# EAGLE design Jalousie_1K_0.1 (EAGLE 5.04)
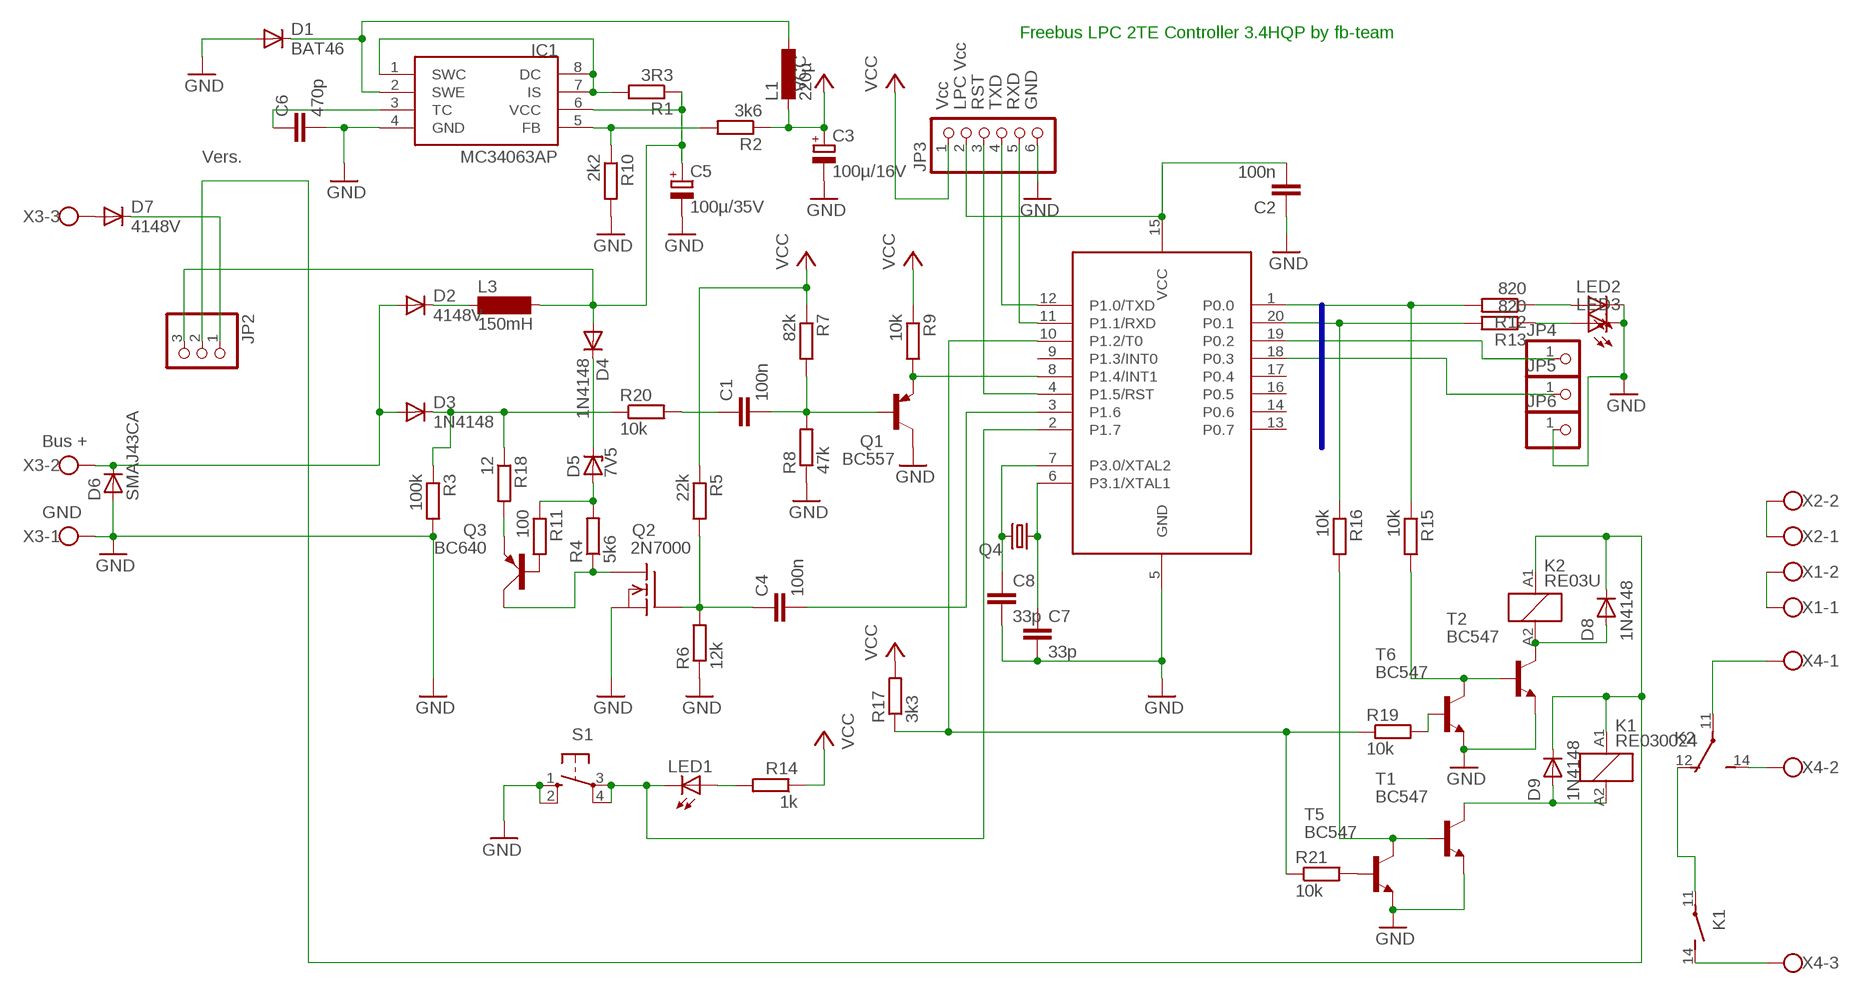
[diagram p0: schematic, sheet 1]

## Parts
C1  100n  C-EU050-024X044  [C050-024X044]
C2  100n  C-EU050-024X044  [C050-024X044]
C3  100µ/16V  CPOL-EUE2.5-5  [E2,5-5]
C4  100n  C-EU050-024X044  [C050-024X044]
C5  100µ/35V  CPOL-EUE3.5-8  [E3,5-8]
C6  470p  C-EU025-024X044  [C025-024X044]
C7  33p  C-EU025-025X050  [C025-025X050]
C8  33p  C-EU025-025X050  [C025-025X050]
D1  BAT46  BAT81  [DO34-7]
D2  4148V  1N41481448V  [D-2.5]
D3  1N4148  1N41481448V  [D-2.5]
D4  1N4148  1N41481448V  [D-2.5]
D5  7V5  ZPD  [DO35Z10]
D6  SMAJ43CA  D-SMB  [SMB]
D7  4148V  1N41481448V  [D-2.5]
D8  1N4148  DO35-STEHEND  [DO35-S]
D9  1N4148  DO35-STEHEND  [DO35-S]
IC1  MC34063AP  [DIL08]
JP2  PINHD-1X3  [1X03]
JP3  PINHD-1X6  [1X06]
JP4  PINHD-1X1  [1X01]
JP5  PINHD-1X1  [1X01]
JP6  PINHD-1X1  [1X01]
K1  RE030024  [RE-SCHRACK]
K2  RE03U  [G5Q_1_EU]
L1  220µ  L-EU0207/12  [0207/12]
L3  150mH  BS11  [BS11]
LED1  LED3MM  [LED3MM]
LED2  LED3MM  [LED3MM]
LED3  LED3MM  [LED3MM]
Q1  BC557  [TO92]
Q2  2N7000  VN2222KM  [TO237]
Q3  BC640  [SOT54D]
Q4  CRYSTALHC49S  [HC49/S]
R1  3R3  R-EU_0207/2V  [0207/2V]
R2  3k6  R-EU_0207/5V  [0207/5V]
R3  100k  R-EU_0207/2V  [0207/2V]
R4  5k6  R-EU_0207/2V  [0207/2V]
R5  22k  R-EU_0207/2V  [0207/2V]
R6  12k  R-EU_0207/2V  [0207/2V]
R7  82k  R-EU_0207/2V  [0207/2V]
R8  47k  R-EU_0207/2V  [0207/2V]
R9  10k  R-EU_0207/2V  [0207/2V]
R10  2k2  R-EU_0207/2V  [0207/2V]
R11  100  R-EU_0207/2V  [0207/2V]
R12  820  R-EU_0207/7  [0207/7]
R13  820  R-EU_0207/10  [0207/10]
R14  1k  R-EU_0207/2V  [0207/2V]
R15  10k  R-EU_0207/7  [0207/7]
R16  10k  R-EU_0207/10  [0207/10]
R17  3k3  R-EU_0207/2V  [0207/2V]
R18  12  R-EU_0207/2V  [0207/2V]
R19  10k  R-EU_0207/7  [0207/7]
R20  10k  R-EU_0207/2V  [0207/2V]
R21  10k  R-EU_0207/7  [0207/7]
S1  10-XX  [B3F-10XX]
T1  BC547  [TO92]
T2  BC547  [TO92]
T5  BC547  [TO92]
T6  BC547  [TO92]
U1  89LPC922  [DIL20]
X1  W237-02P  [W237-132]
X2  W237-02P  [W237-132]
X3  W237-3E  [W237-3E]
X4  W237-03P  [W237-133]

## Nets
EIB+: D2.A D3.A D6.1(C) X3.2
GND: C2.1 C3.- C5.- C6.2 C7.2 C8.2 D1.A D6.2(A) IC1.4(GND) JP3.6 JP6.1 LED2.K(C) LED3.K(C) Q1.3(C) Q2.3(S) R3.2 R6.1 R8.1 R10.2 S1.1(S) S1.2(S1) T1.1(E) T2.1(E) T5.1(E) T6.1(E) U1.5(GND) X3.1
N$1: Q1.1(E) R9.2 U1.8(P1.4/INT1)
N$2: C1.2 Q1.2(B) R7.2 R8.2
N$3: K2.14(14:S) X4.2
N$4: D3.C R3.1 R18.1 R20.1
N$5: C4.2 U1.3(P1.6)
N$6: K1.14(2:S) X4.3
N$7: LED1.K(C) S1.3(P) S1.4(P1) U1.2(P1.7)
N$8: IC1.1(SWC) IC1.7(IS) IC1.8(DC) R1.2
N$9: LED1.A R14.2
N$10: C5.+ D4.A IC1.6(VCC) JP2.3 L3.2 R1.1
N$11: IC1.5(FB) R2.2 R10.1
N$12: D1.C IC1.2(SWE) L1.1
N$13: D2.C L3.1
N$14: C6.1 IC1.3(TC)
N$15: D4.C D5.C
N$16: K2.11(14:P) X4.1
N$17: K1.11(2:P) K2.12(14:O)
N$18: X1.1 X1.2
N$19: D9.P$1(A) K1.A2 T1.3(C)
N$20: LED2.A R12.1
N$21: LED3.A R13.1
N$22: X2.1 X2.2
N$23: D7.C JP2.1
N$24: D8.P$1(A) K2.A2 T2.3(C)
N$25: D5.A R4.2 R11.1
N$26: Q2.1(D) Q3.C R4.1
N$28: Q3.B R11.2
N$29: JP3.4 U1.12(P1.0/TXD)
N$30: JP3.5 U1.11(P1.1/RXD)
N$31: JP3.3 U1.4(P1.5/RST)
N$32: C2.2 JP3.2 U1.15(VCC)
N$33: Q3.E R18.2
N$34: C4.1 Q2.2(G) R5.2 R6.2
N$35: R15.2 T2.2(B) T6.3(C)
N$36: D7.A X3.3
N$37: R16.2 T1.2(B) T5.3(C)
N$38: JP4.1 U1.19(P0.2)
N$39: JP5.1 U1.18(P0.3)
N$41: C1.1 R20.2
N$43: R19.2 T6.2(B)
N$44: R21.2 T5.2(B)
P0.0: R12.2 R15.1 U1.1(P0.0)
P0.1: R13.2 R16.1 U1.20(P0.1)
PWM: R17.1 R19.1 R21.1 U1.10(P1.2/T0)
VCC: C3.+ JP3.1 L1.2 R2.1 R5.1 R7.1 R9.1 R14.1 R17.2
VDD_IN: D8.P$2(B) D9.P$2(B) JP2.2 K1.A1 K2.A1
XTAL1: C7.1 Q4.1 U1.6(P3.1/XTAL1)
XTAL2: C8.1 Q4.2 U1.7(P3.0/XTAL2)
Unconnected: U1.9(P1.3/INT0) U1.13(P0.7) U1.14(P0.6) U1.16(P0.5) U1.17(P0.4)

## Buses
P0.[0..3]

## Notes on the sheet
- Freebus LPC 2TE Controller 3.4HQP by fb-team
- Vcc | LPC Vcc | RST | TXD | RXD | GND
- Vers.
- Bus +
- GND

## Library data of the parts
C1 C2 C4 C6-C8 = rcl:C-EU: CAPACITOR, European symbol
C3 C5 = rcl:CPOL-EU: POLARIZED CAPACITOR, European symbol
D1 = diode:BAT81: DIODE barrier diode
D2-D4 D7 = diode:1N4148: DIODE high speed (Philips)
D5 = diode:ZPD: Z DIODE 500 mW
D6 = semicon-smd-ipc:D-: DIODE unfilled
D8 D9 = kubi:DO35-STEHEND
IC1 = mc34063:MC34063
JP2 = pinhead:PINHD-1X3: PIN HEADER
JP3 = pinhead:PINHD-1X6: PIN HEADER
JP4-JP6 = pinhead:PINHD-1X1: PIN HEADER
K1 = relay:RE03*: Miniature PCB Relay 1 pole 6 A SCHRACK Source: http://www.schrack.com/.. 5812.pdf
K2 = freebus_relay:RE03U
L1 = rcl:L-EU: INDUCTOR, European symbol
L3 = inductor-neosid:BS: INDUCTOR nominal inductance, magnetically screened
LED1-LED3 = led:LED: LED OSRAM: - CHIPLED LG R971, LG N971, LY N971, LG Q971, LY Q971, LO R971, LY R971 LH N974, LH R974 LS Q976, LO Q976, LY Q976 LO Q996 - Hyper CHIPLED LW Q18S LB Q993, LB Q99A, LB R99A - SideLED LS A670, LO A670, LY A670, LG A670, LP A670 LB A673, LV A673, LT A673, LW A673 LH A674 LY A675 LS A676, LA A676, LO A676, LY A676, LW A676 LS A679, LY A679, LG A679 - Hyper Micro SIDELED® LS Y876, LA Y876, LO Y876, LY Y876 LT Y87S - SmartLED LW L88C, LW L88S LB L89C, LB L89S, LG L890 LS L89K, LO L89K, LY L89K LS L896, LA L896, LO L896, LY L896 - TOPLED LS T670, LO T670, LY T670, LG T670, LP T670 LSG T670, LSP T670, LSY T670, LOP T670, LYG T670 LG T671, LOG T671, LSG T671 LB T673, LV T673, LT T673, LW T673 LH T674 LS T676, LA T676, LO T676, LY T676, LB T676, LH T676, LSB T676, LW T676 LB T67C, LV T67C, LT T67C, LS T67K, LO T67K, LY T67K, LW E67C LS E67B, LA E67B, LO E67B, LY E67B, LB E67C, LV E67C, LT E67C LW T67C LS T679, LY T679, LG T679 LS T770, LO T770, LY T770, LG T770, LP T770 LB T773, LV T773, LT T773, LW T773 LH T774 LS E675, LA E675, LY E675, LS T675 LS T776, LA T776, LO T776, LY T776, LB T776 LHGB T686 LT T68C, LB T68C - Hyper Mini TOPLED® LB M676 - Mini TOPLED Santana® LG M470 LS M47K, LO M47K, LY M47K Source: http://www.osram.convergy.de - LUMILED® LXK2-PW12-R00, LXK2-PW12-S00, LXK2-PW14-U00, LXK2-PW14-V00 LXK2-PM12-R00, LXK2-PM12-S00, LXK2-PM14-U00 LXK2-PE12-Q00, LXK2-PE12-R00, LXK2-PE12-S00, LXK2-PE14-T00, LXK2-PE14-U00 LXK2-PB12-K00, LXK2-PB12-L00, LXK2-PB12-M00, LXK2-PB14-N00, LXK2-PB14-P00, LXK2-PB14-Q00 LXK2-PR12-L00, LXK2-PR12-M00, LXK2-PR14-Q00, LXK2-PR14-R00 LXK2-PD12-Q00, LXK2-PD12-R00, LXK2-PD12-S00 LXK2-PH12-R00, LXK2-PH12-S00 LXK2-PL12-P00, LXK2-PL12-Q00, LXK2-PL12-R00 Source: www.luxeon.com
Q1 = transistor-pnp:BC557: PNP Transistor
Q2 = transistor-fet:VN2222KM: N-Channel Enhancement MOSFET (VMOS); 60V; 0,5A; 7,5Ohm
Q3 = transistor-small-signal:BC640: PNP TRANSISTOR
Q4 = crystal:CRYSTAL: CRYSTAL
R1-R21 = rcl:R-EU_: RESISTOR, European symbol
S1 = switch-omron:10-XX: OMRON SWITCH
T1 T2 T5 T6 = transistor-npn:BC547*: NPN Transistor
U1 = micro-philips:89LPC922
X1 X2 = con-wago-508:W237-02P: WAGO SREW CLAMP
X3 = con-wago-508:W237-3E: WAGO SREW CLAMP
X4 = con-wago-508:W237-03P: WAGO SREW CLAMP

## Board
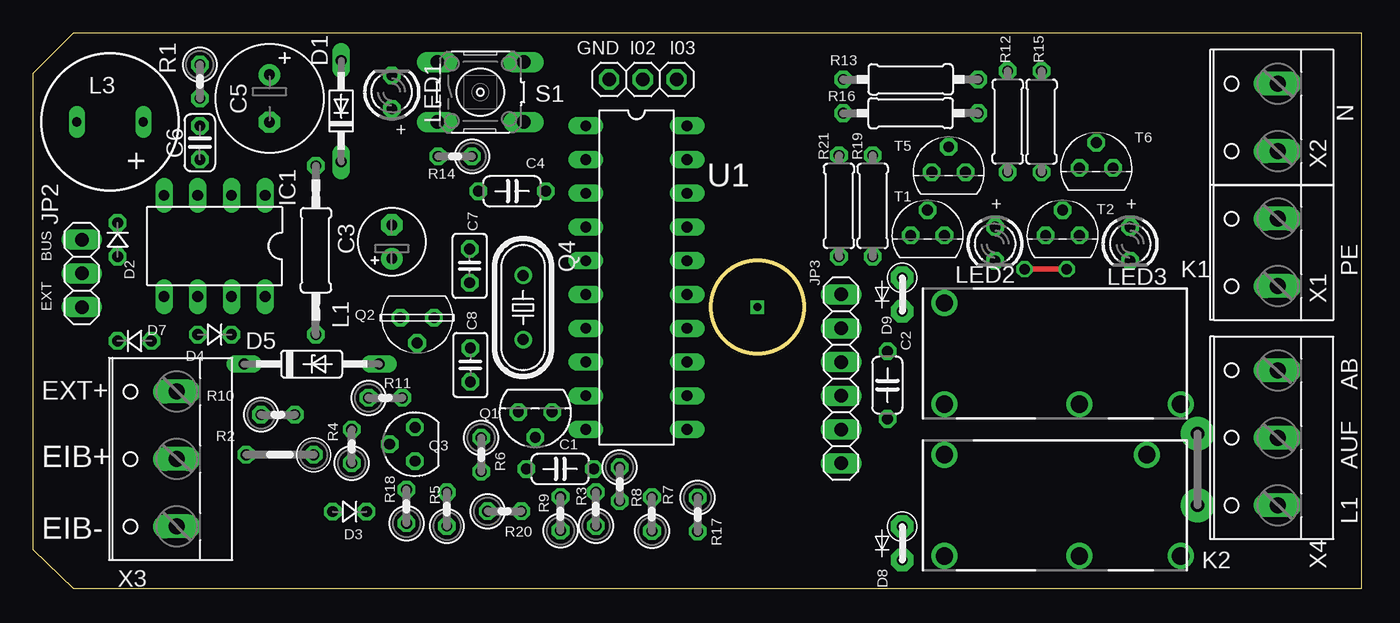
[diagram p1: board, top side]
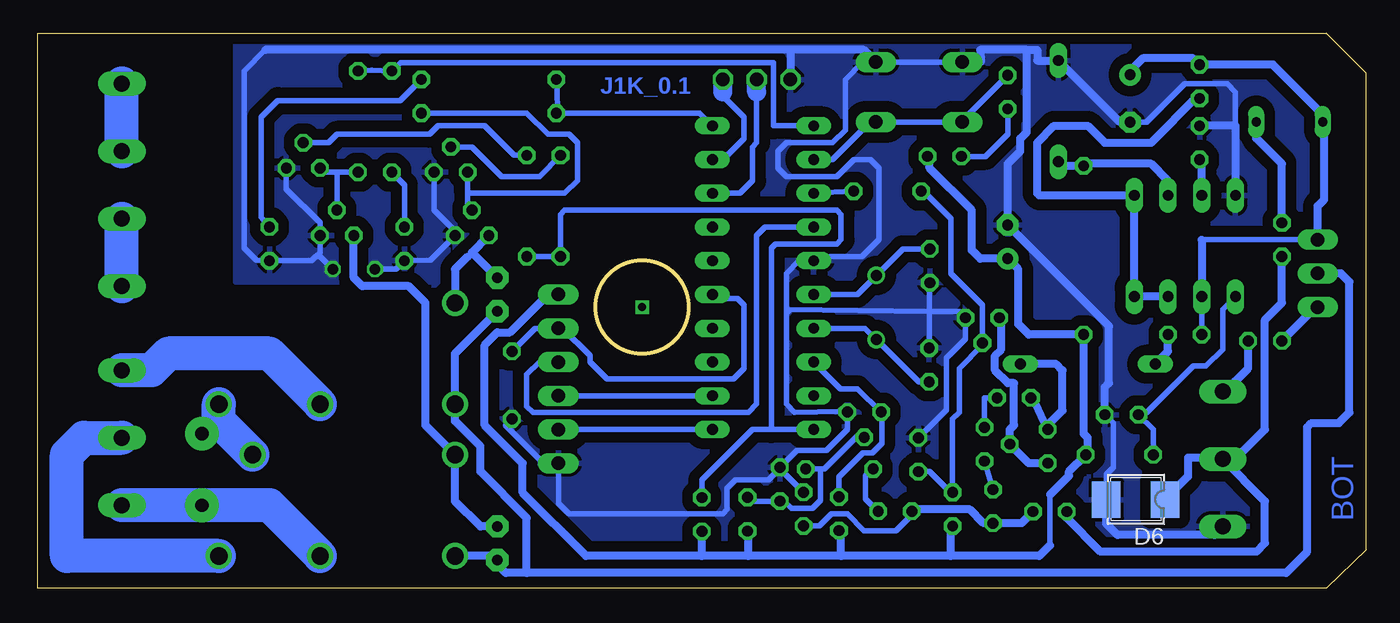
[diagram p2: board, bottom side, seen from below]

Size 100 x 41.8 mm. Coordinates in mm from the lower left corner, seen from the top.
Outline: 0,2.9 3,0 100,0 100,41.8 3,41.8 0,38.8 0,2.9
Outline: circle at 54.5,21.17 radius 3.49
Copper layers (1*16): Top 0.035mm / dielectric 1.5mm / Bottom 0.035mm
Design rules "default *": minimum track width 10mil, minimum drill 24mil, track to track 8mil, track to pad 8mil, pad to pad 8mil, via to via 8mil, smd to smd 8mil, copper to edge 25mil, drill to drill 8mil, minimum pad ring 10mil, minimum via ring 8mil, stop-mask expansion 4mil, vias tented up to drill 0mil, thermal gap 10mil

### Footprints (pad centres in the part's own frame; a part is rotated, then mirrored left to right if it is on the bottom)
C050-024X044 = drill 0.813 octagon: 1 -2.54,0; 2 2.54,0
E2,5-5 = drill 0.813 pad 1.6 round: + -1.27,0 | drill 0.813 pad 1.6 octagon: - 1.27,0
E3,5-8 = drill 0.813 pad 1.6 round: + -1.778,0 | drill 0.813 pad 1.6 octagon: - 1.778,0
C025-024X044 = drill 0.813 octagon: 1 -1.27,0; 2 1.27,0
C025-025X050 = drill 0.813 octagon: 1 -1.27,0; 2 1.27,0
DO34-7 = drill 0.813 long: A 3.81,0; C -3.81,0
D-2.5 = drill 0.813 octagon: A 1.27,0; C -1.27,0
DO35Z10 = drill 0.813 long: A 5.08,0; C -5.08,0
SMB = smd 2.159 x 2.743: 1 -2.311,-0.127; 2 2.108,-0.102
DO35-S = drill 0.8 pad 1.676 octagon: P$1 -1.27,0; P$2 1.27,0
DIL08 = drill 0.813 long: 1 -3.81,-3.81; 2 -1.27,-3.81; 3 1.27,-3.81; 4 3.81,-3.81; 5 3.81,3.81; 6 1.27,3.81; 7 -1.27,3.81; 8 -3.81,3.81
1X03 = drill 1.016 long: 1 -2.54,0; 2 0,0; 3 2.54,0
1X06 = drill 1.016 long: 1 -6.35,0; 2 -3.81,0; 3 -1.27,0; 4 1.27,0; 5 3.81,0; 6 6.35,0
1X01 = drill 1.016 octagon: 1 0,0
RE-SCHRACK = drill 1.3 round: 11 8.89,-3.81; 14 1.27,-3.81; A1 -8.89,-3.81; A2 -8.89,3.81
G5Q_1_EU = drill 1.3 round: 11 1.27,-3.81; 12 6.35,3.81; 14 8.89,-3.81; A1 -8.89,-3.81; A2 -8.89,3.81
0207/12 = drill 0.813 octagon: 1 -6.35,0; 2 6.35,0
BS11 = drill 0.7 long: 1 -2.5,0; 2 2.5,0
LED3MM = drill 0.813 octagon: A -1.27,0; K 1.27,0
TO92 = drill 0.813 octagon: 1 1.27,0; 2 0,1.905; 3 -1.27,0
TO237 = drill 0.813 octagon: 1 1.27,0; 2 0,1.905; 3 -1.27,0
SOT54D = drill 0.813 octagon: B 1.27,0; C 0,1.905; E -1.27,0
HC49/S = drill 0.813 round: 1 -2.413,0; 2 2.413,0
0207/2V = drill 0.813 octagon: 1 -1.27,0; 2 1.27,0
0207/5V = drill 0.813 octagon: 1 -2.54,0; 2 2.54,0
0207/7 = drill 0.813 octagon: 1 -3.81,0; 2 3.81,0
0207/10 = drill 0.813 octagon: 1 -5.08,0; 2 5.08,0
B3F-10XX = drill 1.016 long: 1 -3.251,2.261; 2 3.251,2.261; 3 -3.251,-2.261; 4 3.251,-2.261
DIL20 = drill 0.813 long: 1 -11.43,-3.81; 2 -8.89,-3.81; 3 -6.35,-3.81; 4 -3.81,-3.81; 5 -1.27,-3.81; 6 1.27,-3.81; 7 3.81,-3.81; 8 6.35,-3.81; 9 8.89,-3.81; 10 11.43,-3.81; 11 11.43,3.81; 12 8.89,3.81; 13 6.35,3.81; 14 3.81,3.81; 15 1.27,3.81; 16 -1.27,3.81; 17 -3.81,3.81; 18 -6.35,3.81; 19 -8.89,3.81; 20 -11.43,3.81
W237-132 = drill 1.194 long: 1 -2.54,-0.635; 2 2.54,-0.635
W237-3E = drill 1.194 long: 1 -5.08,-0.635; 2 0,-0.635; 3 5.08,-0.635
W237-133 = drill 1.194 long: 1 -5.08,-0.635; 2 0,-0.635; 3 5.08,-0.635

### Placement (x,y rotation side)
C1  39.65,8.99 0 top
C2  64.29,15.3 90 top
C3  26.99,26.09 90 top
C4  36.04,29.9 0 top
C5  17.78,36.89 270 top
C6  12.54,33.55 90 top
C7  32.85,24.28 270 top
C8  32.9,16.82 90 top
D1  23.18,35.94 90 top
D2  6.35,26.25 270 top
D3  23.81,5.77 180 top
D4  13.65,19.11 180 top
D5  20.96,16.89 0 top
D6  17.46,6.57 180 bottom
D7  7.62,18.63 0 top
D8  65.41,3.39 270 top
D9  65.41,22.12 270 top
IC1  13.65,25.78 180 top
JP2  3.65,23.71 90 top
JP3  60.8,15.77 270 top
JP4  48.42,38.32 0 top
JP5  45.88,38.32 0 top
JP6  43.34,38.32 0 top
K1  77.47,17.68 0 top
K2  77.47,6.25 0 top
L1  21.27,25.46 270 top
L3  5.78,35.12 180 top
LED1  26.99,37.37 90 top
LED2  72.39,25.93 270 top
LED3  82.55,25.93 270 top
Q1  37.78,13.28 180 top
Q2  28.89,20.38 180 top
Q3  28.73,10.85 90 top
Q4  36.87,21.14 270 top
R1  12.54,38.16 270 top
R2  18.57,10.06 180 top
R3  42.36,5.97 90 top
R4  23.97,10.69 90 top
R5  31.13,5.96 90 top
R6  33.71,10.06 270 top
R7  46.57,5.58 90 top
R8  44.13,7.84 270 top
R9  39.69,5.61 90 top
R10  18.42,13.08 0 top
R11  26.51,14.35 0 top
R12  73.34,35.14 90 top
R13  66.04,38.32 180 top
R14  31.75,32.52 180 top
R15  75.88,35.14 270 top
R16  66.04,35.78 0 top
R17  50,5.56 270 top
R18  28.1,6.17 90 top
R19  63.18,28.79 90 top
R20  35.47,5.8 0 top
R21  60.64,28.79 90 top
S1  33.66,37.36 0 top
T1  67.31,26.57 0 top
T2  77.47,26.57 0 top
T5  68.9,31.33 0 top
T6  80.01,31.65 0 top
U1  45.4,23.39 270 top
X1  93.03,25.3 90 top
X2  93.03,35.46 90 top
X3  10.16,9.74 90 top
X4  93.03,11.33 90 top

### Tracks (layer width: path | path; a pad name or v marks a point on that pad's centre or on a via)
EIB+
  Bottom 0.406: 11.75,9.83 12.57,9.83
  Bottom 0.61: X3.2 7.62,6.57 7.62,3.39 8.26,2.76 20,2.76 22.54,5.3 D3.A | X3.2 10.88,9.83 11.75,9.83 13.42,9.83 13.42,8.42 D6.1 | D2.A 6.35,24.51 6.35,21.49 7.62,20.22 7.62,11.96 9.84,9.74 X3.2
GND  (via drill 0.8)
  Top 0.406: v77.79,24.03 v74.61,24.03
  Bottom 0.406: U1.5 42.7,24.66 43.66,23.71 43.66,21.01 | 43.66,21.01 43.66,13.87 43.02,13.24 39.56,13.31 39.56,13.44 Q1.3 39.05,11.96 40.64,10.38 42.86,10.38 R8.1 | Q2.3 | 43.66,21.01 43.5,20.85 | U1.5 | U1.5 40.64,24.66 40.32,24.98 37.94,24.98 36.67,26.25 36.67,31.65 37.31,32.28 38.58,32.28 39.85,31.01 43.66,31.01 44.29,31.65 44.29,32.92 43.66,33.55 40.16,33.55 39.21,34.51 39.21,38.32 37.9,39.62 S1.2 S1.1 | R8.1 44.16,9.11 44.16,9.05 R3.2 | R8.1 | R8.1 44.56,9.11 | R8.1 44.13,9.03 45.01,8.16 47.47,8.16 48.1,7.52 48.1,5.93 48.42,5.62 60.01,5.62 60.8,6.41 JP3.6 61.91,9.43 64.77,12.28 | R8.1 | 79.06,24.98 79.38,24.66 LED3.K 83.56,24.73 84.45,25.62 84.45,38.95 82.87,40.54 | 79.06,24.98 78.74,25.3 T2.1 78.74,27.52 81.28,30.06 T6.1 | v74.61,24.03 73.01,24.03 LED2.K 70.42,24.73 T1.1 68.58,26.89 70.17,28.47 T5.1 | v77.79,24.03 78.74,24.98 79.06,24.98 | 64.77,12.28 C2.1 | 64.77,12.28 | R6.1 31.59,13.45 31.59,17.36 30.16,18.79 Q2.3 | Q2.3 30.64,20.85 32.86,20.85 | 43.66,21.01 32.86,20.85 | C7.2 32.86,20.85 | C8.2 32.86,18.09 32.86,20.85 | 9.84,34.82 9.84,37.37 10.48,38 13.65,38 16.54,35.11 C5.- | R10.2 19.05,12.44 19.05,9.11 19.57,8.59 D6.2
  Bottom 0.61: 25.56,40.54 24.77,40.54 24.77,39.75 D1.A 18.54,35.11 C5.- | 25.56,40.54 29.05,40.54 29.01,39.62 S1.1 | X3.1 11.43,4.03 18.73,4.03 19.57,4.87 D6.2 | 43.34,40.54 37.82,40.54 S1.2 | 43.34,40.54 82.87,40.54 | 43.34,40.54 JP6.1 | IC1.4 9.84,34.82 C6.2 | C6.2 | R10.2 19.68,15.14 19.37,15.46 19.37,19.74 C3.- 26.99,31.97 26.04,32.92 26.04,33.87 25.56,34.35 25.56,40.54
  pour Bottom (isolate 0.813): -0.16,42.6 -0.16,-0.58 70.17,-0.58 70.17,23.08 85.09,23.08 85.09,41.49 84.77,41.49
N$1
  Bottom 0.406: U1.8 39.57,15.02 38.3,15.02 Q1.1 36.49,13.44 36.47,13.41 36.47,10.91 37.16,10.21 37.87,10.21 39.69,8.39 R9.2
N$2
  Bottom 0.406: 42.16,9.01 42.16,8.99 C1.2 41.06,8.99 | Q1.2 38.24,11.53 40.78,8.99 41.06,8.99 | 41.06,8.99 41.06,9.01 | 41.06,8.99 41.06,6.61 41.66,6.01 43.27,6.01 43.82,6.57 R8.2 46.29,6.57 R7.2
N$3
  Bottom 2.54: X4.2 96.52,11.33 97.79,10.06 97.79,2.44 K2.14
N$4
  Bottom 0.406: R3.1 42.27,4.7 42.27,4.71 41.16,4.71 40.27,5.61 39.06,5.61 37.8,4.35 35.4,4.35 34.2,5.54 R20.1 34.07,5.93
  Bottom 0.61: 34.07,5.93 29.84,5.93 28.81,4.9 R18.1 25.96,4.9 D3.C
N$5
  Bottom 0.406: U1.3 | C4.2 U1.3 | U1.3
N$6
  Bottom 2.54: K1.14 82.55,17.68 90.17,17.68 91.44,16.41 X4.3
N$7
  Bottom 0.406: U1.2 | U1.2 40.16,32.28 37.34,35.1 S1.4 S1.3 30.4,35.22 LED1.K
N$8
  Bottom 0.406: 12.7,37.05 R1.2 | IC1.1 17.46,30.38
  Bottom 0.61: IC1.7 IC1.8 IC1.1 24.61,29.59 24.77,29.74 24.77,33.55 23.5,34.82 20.95,34.82 19.68,33.55 16.19,33.55 12.7,37.05
N$9
  Bottom 0.406: LED1.A 26.99,34.19 28.65,32.52 R14.2
N$10
  Bottom 0.406: JP2.3 12.38,26.25 | IC1.6 D4.A
  Bottom 0.61: IC1.6 12.38,26.25 | C5.+ 17.78,38.95 16.83,39.91 13.02,39.91 R1.1 7.03,39.43 3.28,35.68 L3.2 3.17,35.58 3.17,29.27 3.65,28.79 JP2.3
N$11
  Bottom 0.406: IC1.5 10.79,21.01 10.79,18 12.06,16.73 13.02,16.73 16.51,13.24 R10.1 16.03,11.96 R2.2
N$12
  Bottom 0.61: D1.C 22.86,31.81 L1.1 21.11,31.97 16.19,31.97 14.92,30.7 IC1.2
N$13
  Bottom 0.61: L3.1 8.28,33.9 6.35,31.97 D2.C | D2.C
N$14
  Bottom 0.61: C6.1 12.38,32.13 IC1.3
N$15
  Bottom 0.61: D4.C 14.92,17.84 D5.C
N$16  (via drill 1 pad 2.54)
  Bottom 2.54: K2.11 82.55,6.25 v87.63,6.25 X4.1
N$17
  Bottom 2.54: K2.12 86.36,12.6 K1.11
N$18
  Bottom 2.54: X1.1 X1.2
N$19
  Bottom 0.406: 67.31,25.3 67.63,24.98
  Bottom 0.61: 67.63,24.98 68.58,24.03 K1.A2 | T1.3 67.31,25.3 D9.P$1
N$20
  Bottom 0.406: R12.1 72.39,30.38 LED2.A
N$21
  Bottom 0.406: LED3.A arc20 83.19,27.97 83.19,35.46 81.92,36.73 72.71,36.73 71.18,38.26 | 71.18,38.26 71.03,38.09 R13.1 71.18,38.26
N$22
  Bottom 2.54: X2.1 X2.2
N$23
  Bottom 0.61: D7.C 3.81,21.17 JP2.1
N$24
  Bottom 0.61: T2.3 76.2,23.39 75.56,22.76 72.07,22.76 70.8,21.49 70.8,12.28 K2.A2 68.58,6.57 66.67,4.66 D8.P$1
N$25
  Bottom 0.61: R11.1 24.92,14.03 24.18,12.42 | R4.2 24.18,12.42 | 24.18,12.42 23.84,12.42 22.86,13.39 22.86,16.41 23.34,16.89 D5.A | D5.A
N$26
  Bottom 0.61: R4.1 25.4,9.43 Q3.C 26.83,11.96 26.51,12.28 26.51,15.46 26.99,15.46 27.94,16.41 27.94,17.52 27.46,18 27.46,20.22 Q2.1
N$27  (via drill 1 pad 2.54)
  other vias: 87.63,11.65
N$28
  Bottom 0.406: Q3.B 28.73,14.35 R11.2
N$29
  Bottom 0.406: U1.12 JP3.4
N$30
  Bottom 0.406: U1.11 JP3.5
N$31
  Bottom 0.406: U1.4 45.24,27.2 45.88,26.57 45.88,16.57 45.88,16.41 45.88,13.87 46.51,13.24 62.71,13.24 63.18,13.71 63.18,16.09 62.23,17.04 JP3.3
N$32
  Bottom 0.406: U1.15 48.9,21.81 47.31,21.81 46.83,21.33 46.83,16.57 47.62,15.78 57.15,15.78 58.42,17.04 58.42,17.52 60.48,19.58 JP3.2 62.55,19.58 C2.2
N$33
  Bottom 0.406: R18.2 Q3.E
N$34
  Bottom 0.406: 28.89,18.31 | Q2.2 | Q2.2 28.89,18.31 | Q2.2 | Q2.2 28.89,21.33 31.27,23.71 31.27,27.84 33.34,29.9 C4.1 | R6.2 32.86,8.79 31.3,7.23 R5.2 31.13,12.74 30.64,13.24 30.64,16.57 28.89,18.31 | 28.89,18.31 Q2.2
N$35
  Bottom 0.406: 77.47,31.33 R15.2 | 77.47,31.33 78.42,31.33 T6.3 | T2.2 77.47,31.33
N$36
  Bottom 0.61: D7.A 8.89,16.57 10.64,14.82 X3.3
N$37
  Bottom 0.406: R16.2 63.18,35.78 61.59,34.19 60.01,34.19 59.37,33.55 59.37,30.7 60.33,29.74 67.63,29.74 | T1.2 67.63,28.79 67.63,29.74 | 67.63,29.74 T5.3
N$38
  Bottom 0.406: U1.19 48.42,32.28 46.83,33.87 46.83,35.46 48.42,37.05 48.42,37.37
  Bottom 1.422: 48.42,37.37 JP4.1
N$39
  Bottom 0.406: U1.18 47.15,29.74 46.2,30.7 46.2,33.24 45.88,33.55 45.88,37.37 | U1.18
  Bottom 1.422: 45.88,37.37 JP5.1
N$40  (via drill 0.6)
  other vias: 54.5,21.17
N$41
  Bottom 0.406: C1.1 37.15,8.99 37.16,9.01 37.7,8.48 37.7,6.75 R20.2
N$43
  Bottom 0.406: T6.2 78.11,33.55 77.47,34.19 70.48,34.19 69.85,34.82 66.36,34.82 64.14,32.6 R19.2
N$44
  Bottom 0.406: R21.2 62.23,31.01 65.09,31.01 67.31,33.24 T5.2
P0.0
  Bottom 0.406: R15.1 74.87,39.01 R12.2 72.7,39.59 44.61,39.59 44.61,34.82 U1.1 | U1.1
P0.1
  Bottom 0.406: U1.20 50.16,35.78 R16.1 60.87,36.18 R13.2
PWM
  Bottom 0.406: R17.1 50.01,8.16 46.2,11.96 44.77,11.96 | U1.10 44.77,11.96 | R19.1 R21.1 60.64,28.16 60.33,28.47 39.85,28.47 39.53,28.16 39.53,26.25 39.85,25.93 44.45,25.93 44.77,25.62 44.77,11.96
VCC
  Bottom 0.406: 46.6,4.29 R7.1 | JP3.1 | 61.59,22.12 JP3.1 | R5.1 31.11,4.66 | 23.81,3.23 23.81,7.04
  Bottom 0.61: 61.59,22.12 64.45,19.27 65.41,19.27 66.36,18.31 66.36,12.28 63.5,9.43 63.5,7.2 58.74,2.44 50.01,2.44 | 31.27,2.44 39.53,2.44 | 39.53,2.44 46.51,2.44 | 46.51,2.44 50.01,2.44 | R17.2 50.01,4.28 50.01,2.44 | 46.6,4.29 46.51,4.2 46.51,2.44 | R9.1 39.53,4.19 39.53,2.44 | R5.1 31.27,4.55 31.27,2.44 | R14.1 32.86,32.37 32.86,31.65 29.69,28.47 29.69,25.46 29.05,24.82 C3.+ 26.19,24.03 26.19,19.9 25.4,19.11 L1.2 21.27,11.65 20.95,11.33 20.95,10.06 | R2.1 22.38,8.79 22.38,8.47 23.81,7.04 | R2.1 20.95,10.06 | 20.95,10.06 R2.1 | 23.81,3.23 24.61,2.44 31.27,2.44
VDD_IN
  Bottom 0.61: 63.18,1.17 6.03,1.17 4.45,2.76 4.45,12.12 4.13,12.44 2.06,12.44 1.27,13.24 1.27,23.08 1.91,23.71 JP2.2 | 63.18,1.17 64.77,1.17 65.41,1.8 D8.P$2 65.72,2.44 K2.A1 | D9.P$2 68.58,17.68 K1.A1 68.58,12.6 66.67,10.7 66.67,8.79 63.18,5.3 63.18,1.17
XTAL1
  Bottom 0.406: U1.6 | U1.6 38.3,22.12 Q4.1 34.88,25.55 C7.1
XTAL2
  Bottom 0.406: Q4.2 36.77,18.63 | U1.7 37.72,19.58 Q4.2 | C8.1 33.69,15.55 Q4.2

### Text on the board
Bottom: J1K_0.1 | BOT
tPlace: GND | I02 | I03 | N | + | + | + | + | PE | BUS | EXT | AB | EXT+ | AUF | EIB+ | L1 | EIB-
tDocu: optional für 2 fach out | * | 2 Schließer bestücken ! | *